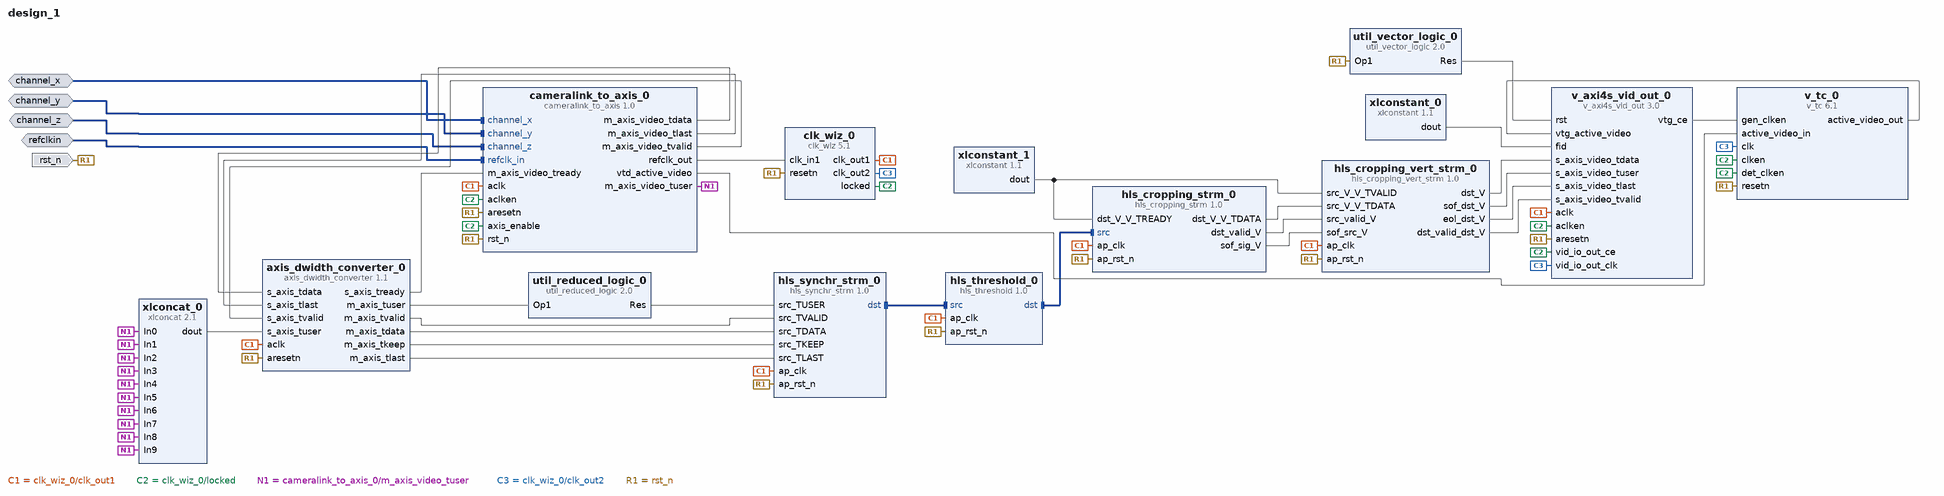
[diagram p0: block diagram of the top level]
# Vivado block design design_1, Vivado 2014.4
create_bd_design design_1

create_bd_intf_port -mode Slave -vlnv xilinx.com:interface:channel_link_rtl:1.0 channel_x
create_bd_intf_port -mode Slave -vlnv xilinx.com:interface:channel_link_rtl:1.0 channel_y
create_bd_intf_port -mode Slave -vlnv xilinx.com:interface:channel_link_rtl:1.0 channel_z
create_bd_intf_port -mode Slave -vlnv xilinx.com:interface:diff_clock_rtl:1.0 refclkin
create_bd_port -dir I rst_n

create_bd_cell -type ip -vlnv Xilinx.com:user:cameralink_to_axis:1.0 cameralink_to_axis_0
create_bd_cell -type ip -vlnv xilinx.com:ip:axis_dwidth_converter:1.1 axis_dwidth_converter_0
set_property -dict [list \
  CONFIG.S_TDATA_NUM_BYTES 10 \
  CONFIG.M_TDATA_NUM_BYTES 8 \
  CONFIG.TUSER_BITS_PER_BYTE 1 \
  CONFIG.HAS_TLAST 1 \
  CONFIG.HAS_MI_TKEEP 1 \
] [get_bd_cells axis_dwidth_converter_0]
create_bd_cell -type ip -vlnv xilinx.com:ip:util_reduced_logic:2.0 util_reduced_logic_0
create_bd_cell -type ip -vlnv xilinx.com:ip:clk_wiz:5.1 clk_wiz_0
set_property -dict [list \
  CONFIG.PRIMITIVE PLL \
  CONFIG.PRIM_IN_FREQ 200 \
  CONFIG.CLKIN1_JITTER_PS 50.0 \
  CONFIG.CLKOUT2_USED true \
  CONFIG.NUM_OUT_CLKS 2 \
  CONFIG.CLKOUT1_REQUESTED_OUT_FREQ 60 \
  CONFIG.CLKOUT2_REQUESTED_OUT_FREQ 60 \
  CONFIG.RESET_TYPE ACTIVE_LOW \
  CONFIG.CLKOUT1_JITTER 216.789 \
  CONFIG.CLKOUT1_PHASE_ERROR 208.392 \
  CONFIG.CLKOUT2_JITTER 216.789 \
  CONFIG.CLKOUT2_PHASE_ERROR 208.392 \
] [get_bd_cells clk_wiz_0]
create_bd_cell -type ip -vlnv xilinx.com:ip:xlconcat:2.1 xlconcat_0
set_property -dict {CONFIG.NUM_PORTS 10} [get_bd_cells xlconcat_0]
create_bd_cell -type ip -vlnv xilinx.com:ip:v_axi4s_vid_out:3.0 v_axi4s_vid_out_0
set_property -dict [list \
  CONFIG.C_S_AXIS_VIDEO_MAX_TDATASMPLS_PER_CLK 1 \
  CONFIG.C_S_AXIS_VIDEO_FORMAT 3 \
] [get_bd_cells v_axi4s_vid_out_0]
create_bd_cell -type ip -vlnv xilinx.com:ip:v_tc:6.1 v_tc_0
set_property -dict [list \
  CONFIG.HAS_AXI4_LITE false \
  CONFIG.SYNC_EN false \
  CONFIG.VIDEO_MODE Custom \
  CONFIG.GEN_F0_VSYNC_VSTART 775 \
  CONFIG.GEN_HACTIVE_SIZE 64 \
  CONFIG.GEN_HSYNC_END 200 \
  CONFIG.GEN_HFRAME_SIZE 64 \
  CONFIG.GEN_F0_VSYNC_HSTART 64 \
  CONFIG.GEN_F0_VSYNC_HEND 64 \
  CONFIG.GEN_F0_VFRAME_SIZE 800 \
  CONFIG.GEN_F0_VSYNC_VEND 790 \
  CONFIG.GEN_F0_VBLANK_HEND 64 \
  CONFIG.GEN_HSYNC_START 150 \
  CONFIG.GEN_VACTIVE_SIZE 768 \
  CONFIG.GEN_F0_VBLANK_HSTART 64 \
  CONFIG.horizontal_sync_generation false \
  CONFIG.enable_detection true \
  CONFIG.vertical_blank_generation false \
  CONFIG.horizontal_blank_detection false \
  CONFIG.horizontal_sync_detection false \
  CONFIG.auto_generation_mode false \
  CONFIG.vertical_sync_generation false \
  CONFIG.vertical_blank_detection true \
  CONFIG.vertical_sync_detection false \
  CONFIG.horizontal_blank_generation false \
] [get_bd_cells v_tc_0]
create_bd_cell -type ip -vlnv xilinx.com:ip:util_vector_logic:2.0 util_vector_logic_0
set_property -dict {CONFIG.C_SIZE 1 CONFIG.C_OPERATION not} [get_bd_cells util_vector_logic_0]
create_bd_cell -type ip -vlnv xilinx.com:ip:xlconstant:1.1 xlconstant_0
set_property -dict {CONFIG.CONST_VAL 0} [get_bd_cells xlconstant_0]
create_bd_cell -type ip -vlnv xilinx.com:hls:hls_cropping_strm:1.0 hls_cropping_strm_0
create_bd_cell -type ip -vlnv xilinx.com:hls:hls_synchr_strm:1.0 hls_synchr_strm_0
create_bd_cell -type ip -vlnv xilinx.com:hls:hls_threshold:1.0 hls_threshold_0
create_bd_cell -type ip -vlnv xilinx.com:ip:xlconstant:1.1 xlconstant_1
create_bd_cell -type ip -vlnv xilinx.com:hls:hls_cropping_vert_strm:1.0 hls_cropping_vert_strm_0

# ---- connections ----

connect_bd_intf_net [get_bd_intf_pins hls_synchr_strm_0/dst] [get_bd_intf_pins hls_threshold_0/src]
connect_bd_intf_net [get_bd_intf_pins hls_threshold_0/dst] [get_bd_intf_pins hls_cropping_strm_0/src]
connect_bd_intf_net [get_bd_intf_ports channel_x] [get_bd_intf_pins cameralink_to_axis_0/channel_x]
connect_bd_intf_net [get_bd_intf_ports channel_y] [get_bd_intf_pins cameralink_to_axis_0/channel_y]
connect_bd_intf_net [get_bd_intf_ports channel_z] [get_bd_intf_pins cameralink_to_axis_0/channel_z]
connect_bd_intf_net [get_bd_intf_ports refclkin] [get_bd_intf_pins cameralink_to_axis_0/refclk_in]
connect_bd_net [get_bd_pins cameralink_to_axis_0/m_axis_video_tdata] [get_bd_pins axis_dwidth_converter_0/s_axis_tdata]
connect_bd_net [get_bd_pins cameralink_to_axis_0/m_axis_video_tlast] [get_bd_pins axis_dwidth_converter_0/s_axis_tlast]
connect_bd_net [get_bd_pins axis_dwidth_converter_0/s_axis_tready] [get_bd_pins cameralink_to_axis_0/m_axis_video_tready]
connect_bd_net [get_bd_pins cameralink_to_axis_0/m_axis_video_tvalid] [get_bd_pins axis_dwidth_converter_0/s_axis_tvalid]
connect_bd_net [get_bd_pins axis_dwidth_converter_0/m_axis_tuser] [get_bd_pins util_reduced_logic_0/Op1]
connect_bd_net [get_bd_pins cameralink_to_axis_0/refclk_out] [get_bd_pins clk_wiz_0/clk_in1]
connect_bd_net [get_bd_pins clk_wiz_0/clk_out1] \
  [get_bd_pins axis_dwidth_converter_0/aclk] [get_bd_pins cameralink_to_axis_0/aclk] [get_bd_pins v_axi4s_vid_out_0/aclk] \
  [get_bd_pins hls_synchr_strm_0/ap_clk] [get_bd_pins hls_threshold_0/ap_clk] [get_bd_pins hls_cropping_strm_0/ap_clk] \
  [get_bd_pins hls_cropping_vert_strm_0/ap_clk]
connect_bd_net [get_bd_pins clk_wiz_0/locked] \
  [get_bd_pins cameralink_to_axis_0/aclken] [get_bd_pins cameralink_to_axis_0/axis_enable] [get_bd_pins v_tc_0/clken] \
  [get_bd_pins v_axi4s_vid_out_0/vid_io_out_ce] [get_bd_pins v_axi4s_vid_out_0/aclken] [get_bd_pins v_tc_0/det_clken]
connect_bd_net [get_bd_pins cameralink_to_axis_0/m_axis_video_tuser] \
  [get_bd_pins xlconcat_0/In0] [get_bd_pins xlconcat_0/In1] [get_bd_pins xlconcat_0/In2] [get_bd_pins xlconcat_0/In3] \
  [get_bd_pins xlconcat_0/In4] [get_bd_pins xlconcat_0/In5] [get_bd_pins xlconcat_0/In6] [get_bd_pins xlconcat_0/In7] \
  [get_bd_pins xlconcat_0/In8] [get_bd_pins xlconcat_0/In9]
connect_bd_net [get_bd_pins xlconcat_0/dout] [get_bd_pins axis_dwidth_converter_0/s_axis_tuser]
connect_bd_net [get_bd_pins clk_wiz_0/clk_out2] [get_bd_pins v_tc_0/clk] [get_bd_pins v_axi4s_vid_out_0/vid_io_out_clk]
connect_bd_net [get_bd_pins v_axi4s_vid_out_0/vtg_ce] [get_bd_pins v_tc_0/gen_clken]
connect_bd_net [get_bd_pins v_tc_0/active_video_out] [get_bd_pins v_axi4s_vid_out_0/vtg_active_video]
connect_bd_net [get_bd_pins util_vector_logic_0/Res] [get_bd_pins v_axi4s_vid_out_0/rst]
connect_bd_net [get_bd_pins xlconstant_0/dout] [get_bd_pins v_axi4s_vid_out_0/fid]
connect_bd_net [get_bd_pins cameralink_to_axis_0/vtd_active_video] [get_bd_pins v_tc_0/active_video_in]
connect_bd_net [get_bd_ports rst_n] \
  [get_bd_pins axis_dwidth_converter_0/aresetn] [get_bd_pins clk_wiz_0/resetn] [get_bd_pins v_tc_0/resetn] \
  [get_bd_pins v_axi4s_vid_out_0/aresetn] [get_bd_pins cameralink_to_axis_0/aresetn] [get_bd_pins cameralink_to_axis_0/rst_n] \
  [get_bd_pins util_vector_logic_0/Op1] [get_bd_pins hls_synchr_strm_0/ap_rst_n] [get_bd_pins hls_threshold_0/ap_rst_n] \
  [get_bd_pins hls_cropping_strm_0/ap_rst_n] [get_bd_pins hls_cropping_vert_strm_0/ap_rst_n]
connect_bd_net [get_bd_pins hls_cropping_strm_0/dst_V_V_TDATA] [get_bd_pins hls_cropping_vert_strm_0/src_V_V_TDATA]
connect_bd_net [get_bd_pins hls_cropping_strm_0/dst_valid_V] [get_bd_pins hls_cropping_vert_strm_0/src_valid_V]
connect_bd_net [get_bd_pins hls_cropping_strm_0/sof_sig_V] [get_bd_pins hls_cropping_vert_strm_0/sof_src_V]
connect_bd_net [get_bd_pins hls_cropping_vert_strm_0/dst_V] [get_bd_pins v_axi4s_vid_out_0/s_axis_video_tdata]
connect_bd_net [get_bd_pins hls_cropping_vert_strm_0/sof_dst_V] [get_bd_pins v_axi4s_vid_out_0/s_axis_video_tuser]
connect_bd_net [get_bd_pins hls_cropping_vert_strm_0/eol_dst_V] [get_bd_pins v_axi4s_vid_out_0/s_axis_video_tlast]
connect_bd_net [get_bd_pins hls_cropping_vert_strm_0/dst_valid_dst_V] [get_bd_pins v_axi4s_vid_out_0/s_axis_video_tvalid]
connect_bd_net [get_bd_pins xlconstant_1/dout] [get_bd_pins hls_cropping_strm_0/dst_V_V_TREADY] [get_bd_pins hls_cropping_vert_strm_0/src_V_V_TVALID]
connect_bd_net [get_bd_pins axis_dwidth_converter_0/m_axis_tvalid] [get_bd_pins hls_synchr_strm_0/src_TVALID]
connect_bd_net [get_bd_pins axis_dwidth_converter_0/m_axis_tdata] [get_bd_pins hls_synchr_strm_0/src_TDATA]
connect_bd_net [get_bd_pins axis_dwidth_converter_0/m_axis_tkeep] [get_bd_pins hls_synchr_strm_0/src_TKEEP]
connect_bd_net [get_bd_pins axis_dwidth_converter_0/m_axis_tlast] [get_bd_pins hls_synchr_strm_0/src_TLAST]
connect_bd_net [get_bd_pins util_reduced_logic_0/Res] [get_bd_pins hls_synchr_strm_0/src_TUSER]

validate_bd_design
save_bd_design
